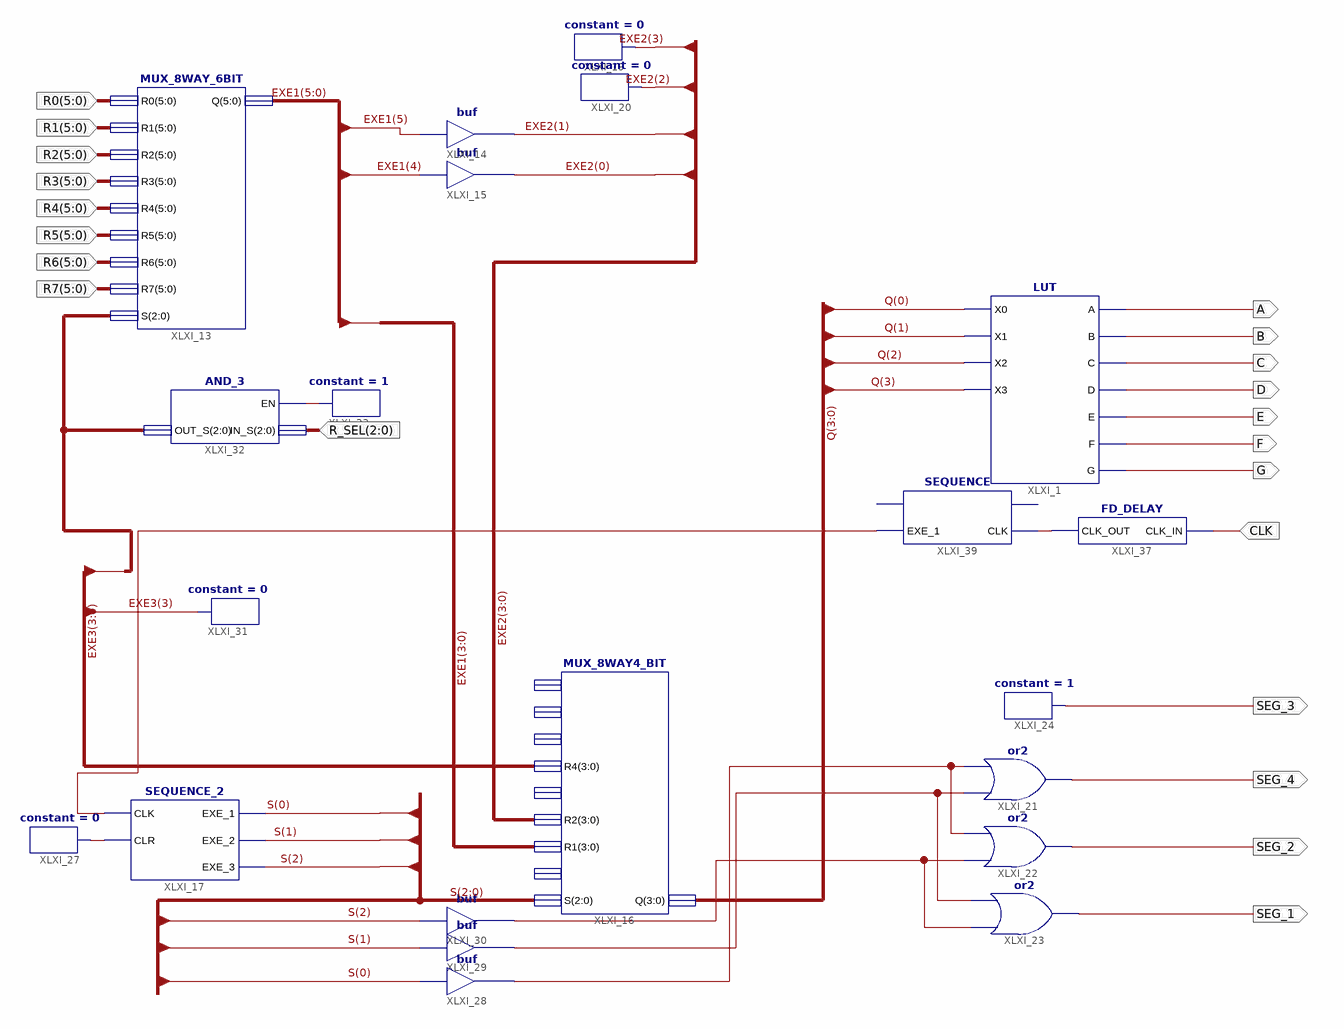
[diagram p0: schematic sheet 1]
// Xilinx ISE schematic SEVEN_SEG_6.sch (spartan3e) as structural Verilog: 21 symbols, 22 ports
module SEVEN_SEG_6 (
  input  [5:0] R0,
  input  [5:0] R1,
  input  [5:0] R2,
  input  [5:0] R3,
  input  [5:0] R4,
  input  [5:0] R5,
  input  [5:0] R6,
  input  [5:0] R7,
  input  [2:0] R_SEL,
  input  CLK,
  inout  [2:0] S,
  output A,
  output B,
  output C,
  output D,
  output E,
  output F,
  output G,
  output SEG_4,
  output SEG_2,
  output SEG_1,
  output SEG_3
);

  wire XLXN_78, XLXN_82, XLXN_85, XLXN_90, XLXN_105, XLXN_109, XLXN_110;
  wire [3:0] EXE2, EXE3, Q;
  wire [5:0] EXE1;

  LUT XLXI_1 (.A(A), .B(B), .C(C), .D(D), .E(E), .F(F), .G(G), .X0(Q[0]), .X1(Q[1]), .X2(Q[2]), .X3(Q[3]));
  MUX_8WAY_6BIT XLXI_13 (
    .Q(EXE1), .R0(R0), .R1(R1), .R2(R2), .R3(R3), .R4(R4), .R5(R5), .R6(R6), .R7(R7), .S(EXE3[2:0]));
  buf XLXI_14 (EXE2[1], EXE1[5]);
  buf XLXI_15 (EXE2[0], EXE1[4]);
  MUX_8WAY4_BIT XLXI_16 (.Q(Q), .R1(EXE1[3:0]), .R2(EXE2), .R4(EXE3), .S(S));  // open: R0, R3, R5, R6, R7
  SEQUENCE_2 XLXI_17 (.CLK(XLXN_110), .CLR(XLXN_78), .EXE_1(S[0]), .EXE_2(S[1]), .EXE_3(S[2]));
  constant #(.CValue("0")) XLXI_19 (.O(EXE2[3]));
  constant #(.CValue("0")) XLXI_20 (.O(EXE2[2]));
  or XLXI_21 (SEG_4, XLXN_85, XLXN_82);
  or XLXI_22 (SEG_2, XLXN_90, XLXN_82);
  or XLXI_23 (SEG_1, XLXN_90, XLXN_85);
  constant #(.CValue("1")) XLXI_24 (.O(SEG_3));
  constant #(.CValue("0")) XLXI_27 (.O(XLXN_78));
  buf XLXI_28 (XLXN_82, S[0]);
  buf XLXI_29 (XLXN_85, S[1]);
  buf XLXI_30 (XLXN_90, S[2]);
  constant #(.CValue("0")) XLXI_31 (.O(EXE3[3]));
  AND_3 XLXI_32 (.EN(XLXN_105), .IN_S(R_SEL), .OUT_S(EXE3[2:0]));
  constant #(.CValue("1")) XLXI_33 (.O(XLXN_105));
  FD_DELAY XLXI_37 (.CLK_IN(CLK), .CLK_OUT(XLXN_109));
  SEQUENCE XLXI_39 (.CLK(XLXN_109), .EXE_1(XLXN_110));  // open: CLR, EXE_2
endmodule
